# Altium schematic sheet receiver_plane_2S.SchDoc
size A3
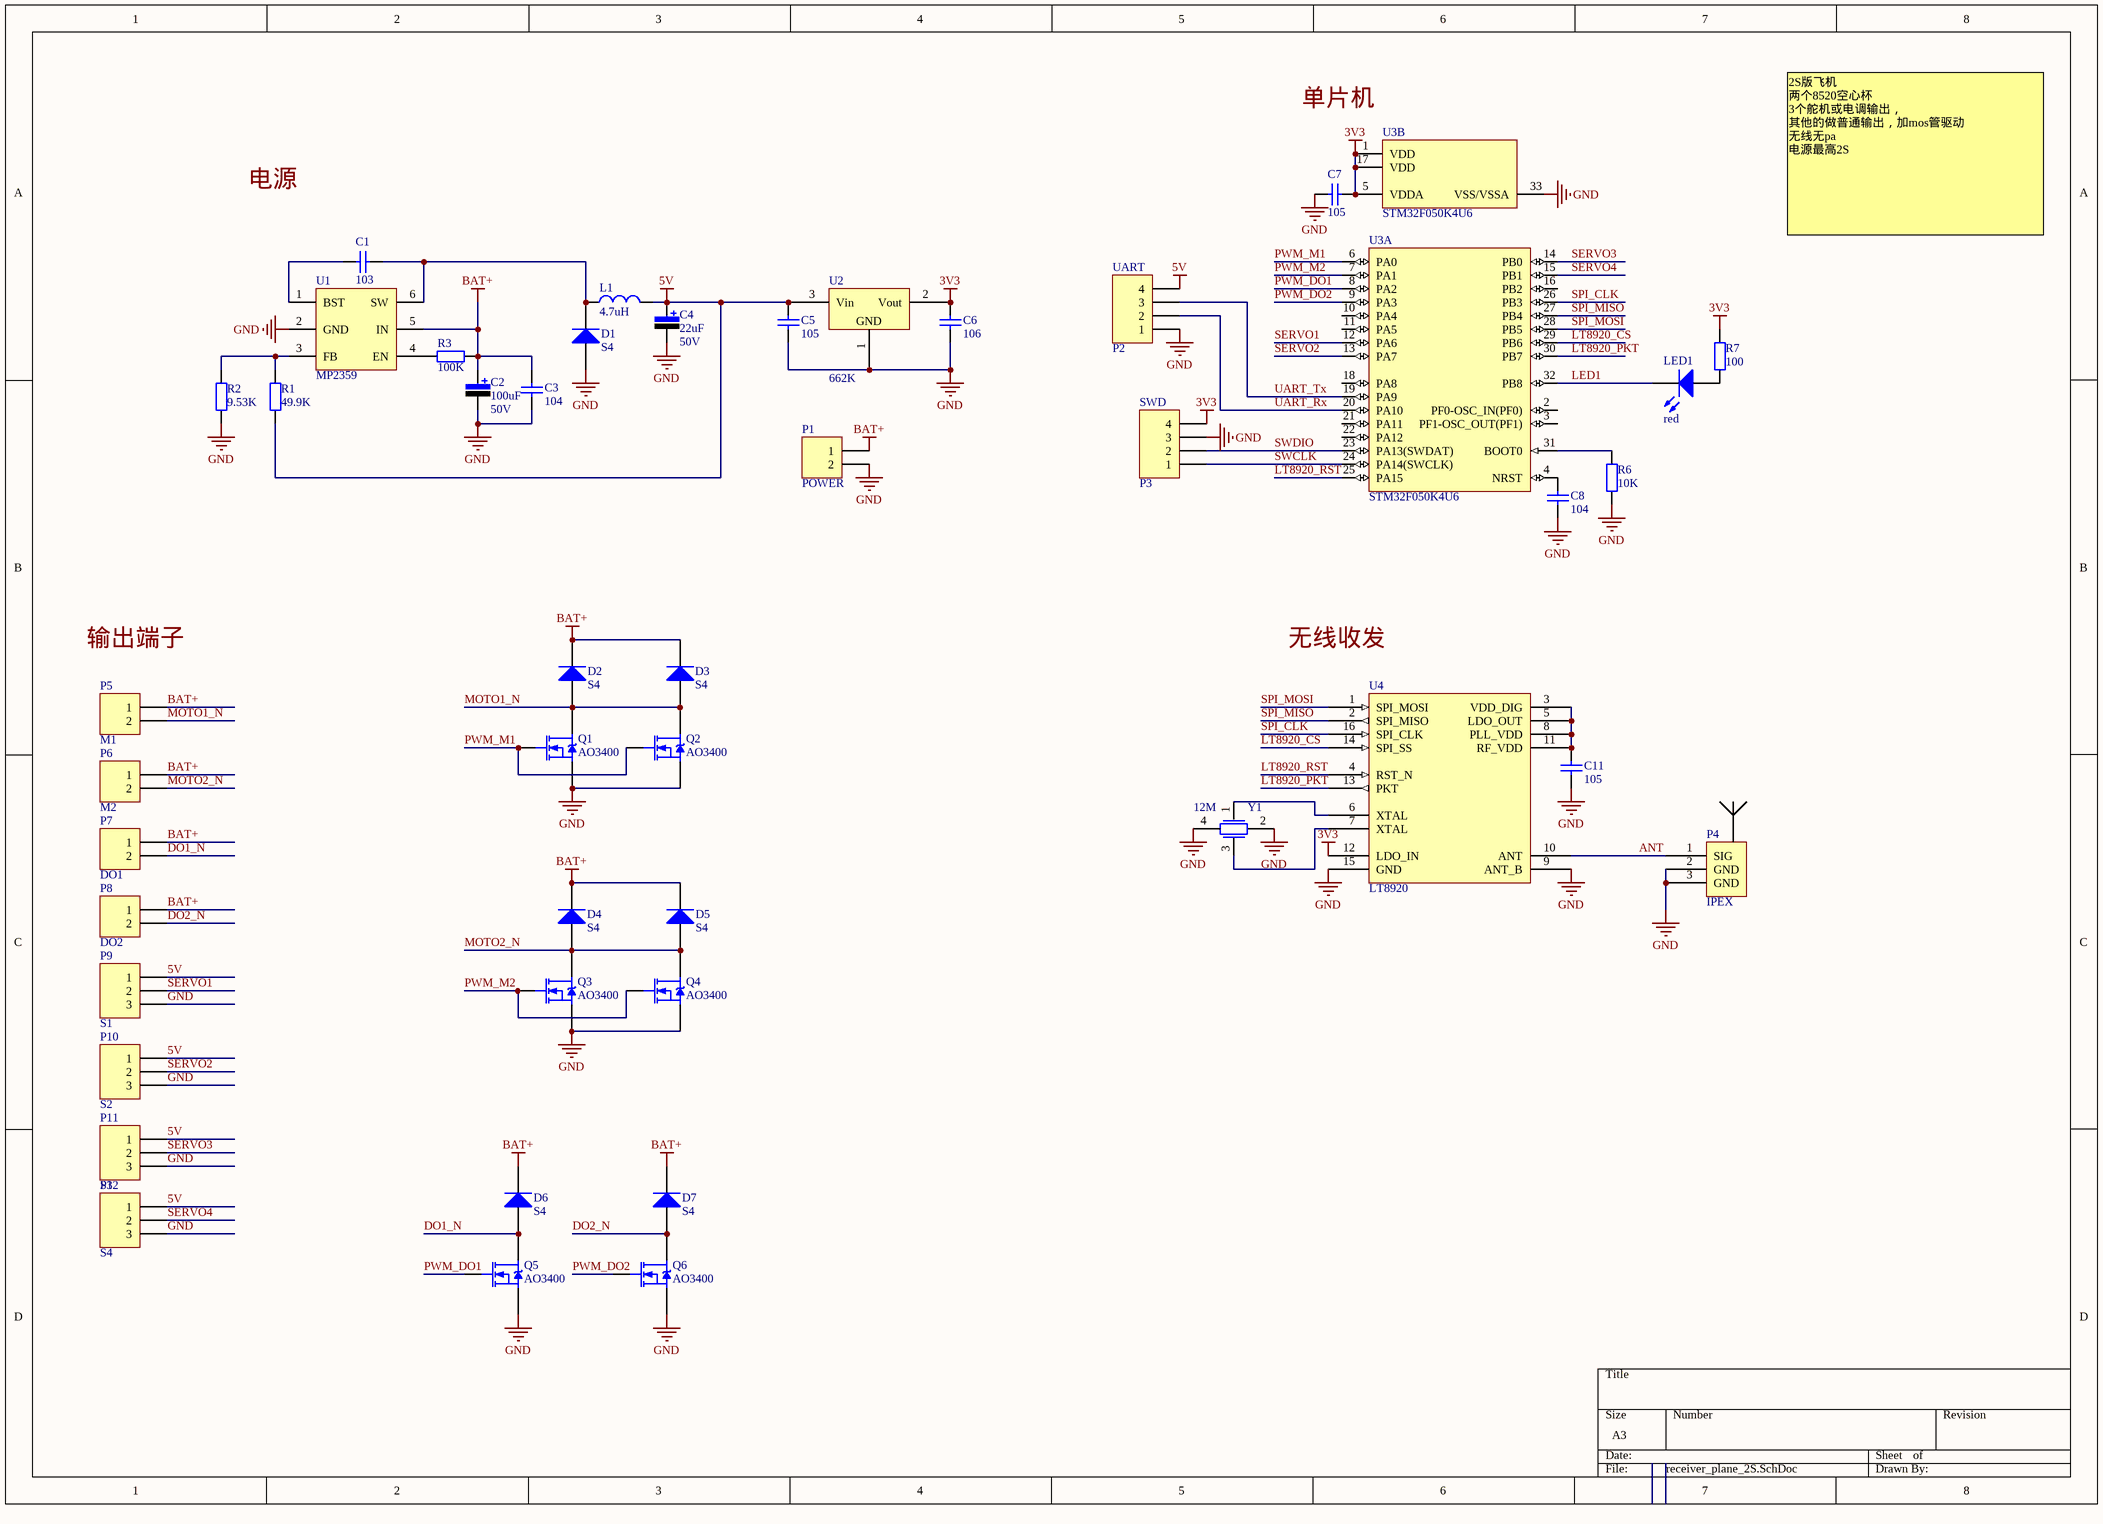
[diagram p0: receiver_plane_2S.SchDoc]

## Parts
C1  103  [0805-2]
C2  value 100uF  Vol: 50V  [C-RB-S6]  (hidden comment: Cap Pol)
C3  104  [0805-2]
C4  value 22uF  Vol: 50V  [C-RB-S6]  (hidden comment: Cap Pol)
C5  value 105  [0805-2]  (hidden comment: Cap)
C6  value 106  [0805-2]  (hidden comment: Cap)
C7  value 105  [0805-2]  (hidden comment: Cap)
C8  value 104  [0805-2]  (hidden comment: Cap)
C11  value 105  [0805-2]  (hidden comment: Cap)
D1  Type: S4  [SOD523]  (hidden comment: 1N5819)
D2  Type: S4  [SOD523]  (hidden comment: 1N5819)
D3  Type: S4  [SOD523]  (hidden comment: 1N5819)
D4  Type: S4  [SOD523]  (hidden comment: 1N5819)
D5  Type: S4  [SOD523]  (hidden comment: 1N5819)
D6  Type: S4  [SOD523]  (hidden comment: 1N5819)
D7  Type: S4  [SOD523]  (hidden comment: 1N5819)
L1  value 4.7uH  [l-SMD-4]  (hidden comment: Inductor)
LED1  red  [0603-1]
P1  POWER  [HDR2X1_A]
P2  UART  [HDR4*1*1.27]
P3  SWD  [HDR4*1*1.27]
P4  IPEX  [U.FL-R-SMT]
P5  M1  [HDR2X1_A]
P6  M2  [HDR2X1_A]
P7  DO1  [HDR2X1_A]
P8  DO2  [HDR2X1_A]
P9  S1  [HDR3X1_A]
P10  S2  [HDR3X1_A]
P11  S3  [HDR3X1_A]
P12  S4  [HDR3X1_A]
Q1  AO3400  [SOT-23-3L]
Q2  AO3400  [SOT-23-3L]
Q3  AO3400  [SOT-23-3L]
Q4  AO3400  [SOT-23-3L]
Q5  AO3400  [SOT-23-3L]
Q6  AO3400  [SOT-23-3L]
R1  value 49.9K  [0805-2]  (hidden comment: Res1)
R2  value 9.53K  [0805-2]  (hidden comment: Res1)
R3  value 100K  [0805-2]  (hidden comment: Res1)
R6  value 10K  [0805-2]  (hidden comment: Res1)
R7  value 100  [0805-2]  (hidden comment: Res1)
U1  MP2359  [TSOT23-6]
U2  662K  [SOT-23]
U3  STM32F050K4U6  [STM-UFQFPN32_N]  (parts A,B of 2)
U4  LT8920  [SSOP-16 LT8920]
Y1  12M  [XTAL_3225]

## Nets
3V3: C6.1 C7.2 P3.4 R7.2 U2.2(Vout) U3.1(VDD) U3.5(VDDA) U3.17(VDD) U4.12(LDO_IN)
5V: C4.1 C5.1 L1.2 P2.4 P9.1 P10.1 P11.1 P12.1 R1.1 U2.3(Vin)
BAT+: C2.1 C3.2 D2.2(K) D3.2(K) D4.2(K) D5.2(K) D6.2(K) D7.2(K) P1.1 P5.1 P6.1 P7.1 P8.1 R3.1 U1.5(IN)
GND: C2.2 C3.1 C4.2 C5.2 C6.2 C7.1 C8.2 C11.1 D1.1(A) P1.2 P2.1 P3.3 P4.2(GND) P4.3(GND) P9.3 P10.3 P11.3 P12.3 Q1.S Q2.S Q3.S Q4.S Q5.S Q6.S R2.2 R6.2 U1.2(GND) U2.1(Vss) U3.33(VSS/VSSA) U4.9(ANT_B) U4.15(GND) Y1.2 Y1.4
ANT: P4.1(SIG) U4.10(ANT)
DO1_N: D6.1(A) P7.2 Q5.D
DO2_N: D7.1(A) P8.2 Q6.D
LED1: LED1.2(K) U3.32(PB8)
LT8920_CS: U3.29(PB6) U4.14(SPI_SS)
LT8920_PKT: U3.30(PB7) U4.13(PKT)
LT8920_RST: U3.25(PA15) U4.4(RST_N)
MOTO1_N: D2.1(A) D3.1(A) P5.2 Q1.D Q2.D
MOTO2_N: D4.1(A) D5.1(A) P6.2 Q3.D Q4.D
PWM_DO1: Q5.G U3.8(PA2)
PWM_DO2: Q6.G U3.9(PA3)
PWM_M1: Q1.G Q2.G U3.6(PA0)
PWM_M2: Q3.G Q4.G U3.7(PA1)
SERVO1: P9.2 U3.12(PA6)
SERVO2: P10.2 U3.13(PA7)
SERVO3: P11.2 U3.14(PB0)
SERVO4: P12.2 U3.15(PB1)
SPI_CLK: U3.26(PB3) U4.16(SPI_CLK)
SPI_MISO: U3.27(PB4) U4.2(SPI_MISO)
SPI_MOSI: U3.28(PB5) U4.1(SPI_MOSI)
SWCLK: P3.1 U3.24(PA14(SWCLK))
SWDIO: P3.2 U3.23(PA13(SWDAT))
UART_Rx: P2.2 U3.20(PA10)
UART_Tx: P2.3 U3.19(PA9)
NetC1_1: C1.1 U1.1(BST)
NetC1_2: C1.2 D1.2(K) L1.1 U1.6(SW)
NetC8_1: C8.1 U3.4(NRST)
NetC11_2: C11.2 U4.3(VDD_DIG) U4.5(LDO_OUT) U4.8(PLL_VDD) U4.11(RF_VDD)
NetLED1_1: LED1.1(A) R7.1
NetR1_2: R1.2 R2.1 U1.3(FB)
NetR3_2: R3.2 U1.4(EN)
NetR6_1: R6.1 U3.31(BOOT0)
NetU4_6: U4.6(XTAL) Y1.1
NetU4_7: U4.7(XTAL) Y1.3

Not connected (* = marked no-connect by the designer): U3 2(PF0-OSC_IN(PF0)) 3(PF1-OSC_OUT(PF1)) 10(PA4) 11(PA5) 16(PB2) 18(PA8) 21(PA11) 22(PA12)

## Notes on the sheet
- 单片机
- 电源
- 2S版飞机
  两个8520空心杯
  3个舵机或电调输出，
  其他的做普通输出，加mos管驱动
  无线无pa
  电源最高2S
- 输出端子
- 无线收发
- (in symbol 662K) GND

## Library data of the parts
C1 = Cap Semi: Capacitor (Semiconductor SIM Model); Published: 8-Jun-2000; LatestRevisionDate: 29-May-2009; LatestRevisionNote: IPC-7351 Footprint Added.; PackageReference: C1206; Publisher: Altium Limited; PackageDescription: Chip Capacitor; Value: 103
C2 C4 = Cap Pol: 极性电解电容; Published: 8-Jun-2000; LatestRevisionDate: 17-Jul-2002; LatestRevisionNote: Re-released for DXP Platform.; PackageReference: RB7.6-15; Publisher: Altium Limited
C3 = Cap Semi: Capacitor (Semiconductor SIM Model); Value: 106; Published: 8-Jun-2000; LatestRevisionDate: 29-May-2009; LatestRevisionNote: IPC-7351 Footprint Added.; PackageReference: C1206; Publisher: Altium Limited; PackageDescription: Chip Capacitor
C5-C8 C11 = Cap: 无极性电容; Published: 8-Jun-2000; LatestRevisionDate: 17-Jul-2002; LatestRevisionNote: Re-released for DXP Platform.; PackageReference: RAD-0.3; Publisher: Altium Limited
D1-D7 = Diode: 二极管; Published: 8-Jun-2000; LatestRevisionDate: 17-Jul-2002; LatestRevisionNote: Re-released for DXP Platform.; PackageDocument: Sep-1996; PackageReference: SMC; Publisher: Altium Limited; Code_JEDEC: DO-214-AB
L1 = Inductor: 电感; Code_IEC: 1005; Published: 8-Jun-2000; LatestRevisionDate: 17-Jul-2002; LatestRevisionNote: Re-released for DXP Platform.; PackageReference: 0402-A; Publisher: Altium Limited; Code_JEITA: 0402
LED1 = LED3: Typical BLUE SiC LED; Published: 8-Jun-2000; LatestRevisionDate: 17-Dec-2003; LatestRevisionNote: PCB Footprint replaced.; DatasheetVersion: 16-Apr-2002; PackageVersion: 16-Apr-2002; PackageReference: 3.5X2.8X1.9; Publisher: Altium Limited; PackageDescription: SM LED; 2 C-Bend Leads; Body 3.5 x 2.8 x 1.9 mm, inc leads (LxWxH typ)
P1 P5-P8 = Header 2: 接插件; LatestRevisionDate: 17-Jul-2002; LatestRevisionNote: Re-released for DXP Platform.; Publisher: Altium Limited
P2 P3 = Header 4: 接插件; LatestRevisionDate: 17-Jul-2002; LatestRevisionNote: Re-released for DXP Platform.; Publisher: Altium Limited
P4 = IPEX: U.FL-R-SMT
P9-P12 = Header 3: 接插件; LatestRevisionDate: 17-Jul-2002; LatestRevisionNote: Re-released for DXP Platform.; Publisher: Altium Limited
Q1-Q6 = MOSFET-N: N-Channel MOSFET; PackageDocument: 1995/1996; Published: 8-Jun-2000; LatestRevisionDate: 17-Jul-2002; LatestRevisionNote: Re-released for DXP Platform.; PackageReference: E3; Publisher: Altium Limited
R1-R3 R6 R7 = Res1: 贴片电阻; Published: 8-Jun-2000; LatestRevisionDate: 17-Jul-2002; LatestRevisionNote: Re-released for DXP Platform.; PackageReference: AXIAL-0.4; Publisher: Altium Limited
U3 = STM32F050K4U6: ARM Cortex-M0 32-bit MCU, 16 KB Flash, 4 KB Internal RAM, 27 I/Os, 32-pin UFQFPN, -40 to 85 degC, Tray; FLASH Size (Prog) (kB): 16; I/Os (High Current): 27; Internal RAM Size (kB): 4; Operating Frequency(F) (Processor speed) (MHz): 48; Supply Voltage(Vcc) min (V): 2; DatasheetVersion: Rev. 1; PackageVersion: Rev. 3, 07/2012; PackageReference: UFQFPN32; PackageDescription: 32-Pin Ultra Thin Fine Pitch Quad Flat No-Lead, 5 x 5 x 0.6 mm Body, 0.5 mm Pitch, Exposed Pad; Supplier 1: Digi-Key; Supplier Part Number 1: 497-13621-ND; Supplier 2: Farnell; Supplier Part Number 2: 2333139; Supplier 3: Newark; Supplier Part Number 3: 99W9752; Supplier 4: Newark; Supplier Part Number 4: 48W6864; Supplier 5: Mouser; Supplier Part Number 5: 511-STM32F050K4U6; Core: ARM Cortex-M0; Packing: Tray; Mounting Technology: Surface Mount; PartNumber: STM32F050K4U6; ComponentLink1Description: Manufacturer URL; ComponentLink1URL: http://www.st.com/web/en/home.html; ComponentLink2Description: Datasheet; ComponentLink2URL: http://www.st.com/st-web-ui/static/active/en/resource/technical/document/datasheet/DM00065136.pdf; ComponentLink3Description: Package Specification; ComponentLink3URL: http://www.st.com/st-web-ui/static/active/en/resource/technical/document/datasheet/DM00039193.pdf
Y1 = XTAL-4PIN: 贴片晶振